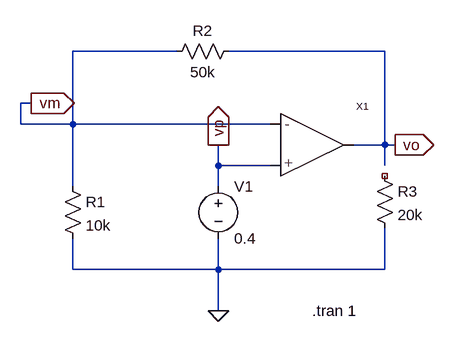
[diagram p0: schematic Exercise 5-28.asc]
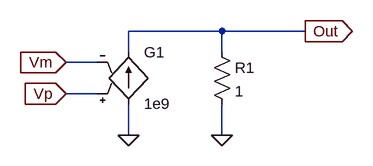
[diagram p1: sub-circuit op_amp.asc]
Exercise 5-28.asc, the LTspice schematic file:
Version 4
SHEET 1 880 680
WIRE 48 16 -112 16
WIRE 368 16 128 16
WIRE -176 96 -192 96
WIRE -192 128 -192 96
WIRE -112 128 -112 16
WIRE -112 128 -192 128
WIRE 192 128 -112 128
WIRE 368 160 368 16
WIRE 368 160 320 160
WIRE 384 160 368 160
WIRE 112 192 112 160
WIRE 192 192 112 192
WIRE 368 192 368 160
WIRE -112 224 -112 128
WIRE 112 224 112 192
WIRE -112 352 -112 304
WIRE 112 352 112 304
WIRE 112 352 -112 352
WIRE 368 352 368 288
WIRE 368 352 112 352
WIRE 112 416 112 352
FLAG 112 416 0
FLAG 384 160 vo
IOPIN 384 160 Out
FLAG 112 160 vp
IOPIN 112 160 Out
FLAG -176 96 vm
IOPIN -176 96 Out
SYMBOL op_amp 208 160 R0
SYMATTR InstName X1
SYMBOL voltage 112 208 R0
WINDOW 123 0 0 Left 0
WINDOW 39 0 0 Left 0
SYMATTR InstName V1
SYMATTR Value 0.4
SYMBOL res -128 208 R0
SYMATTR InstName R1
SYMATTR Value 10k
SYMBOL res 144 0 R90
WINDOW 0 0 56 VBottom 2
WINDOW 3 32 56 VTop 2
SYMATTR InstName R2
SYMATTR Value 50k
SYMBOL res 352 192 R0
SYMATTR InstName R3
SYMATTR Value 20k
TEXT 256 416 Left 2 !.tran 1

op_amp.asc, the sub-circuit schematic file:
Version 4
SHEET 1 880 680
WIRE 304 176 160 176
WIRE 432 176 304 176
WIRE 160 208 160 176
WIRE 304 208 304 176
WIRE 112 224 64 224
WIRE 112 272 64 272
WIRE 160 336 160 288
WIRE 304 336 304 288
FLAG 160 336 0
FLAG 304 336 0
FLAG 64 224 Vm
IOPIN 64 224 In
FLAG 64 272 Vp
IOPIN 64 272 In
FLAG 432 176 Out
IOPIN 432 176 Out
SYMBOL g2 160 192 R0
SYMATTR InstName G1
SYMATTR Value 1e9
SYMBOL res 288 192 R0
SYMATTR InstName R1
SYMATTR Value 1

The netlist it stands for:
* Exercise 5-28.asc
XX1 vm vp vo op_amp
V1 vp 0 0.4
R1 vm 0 10k
R2 vo vm 50k
R3 NC_01 0 20k

* block symbol definitions
.subckt op_amp Vm Vp Out
G1 0 Out Vp Vm 1e9
R1 Out 0 1
.ends op_amp

.tran 1
.backanno
.end